# Altium schematic sheet Motor.SchDoc
size A4
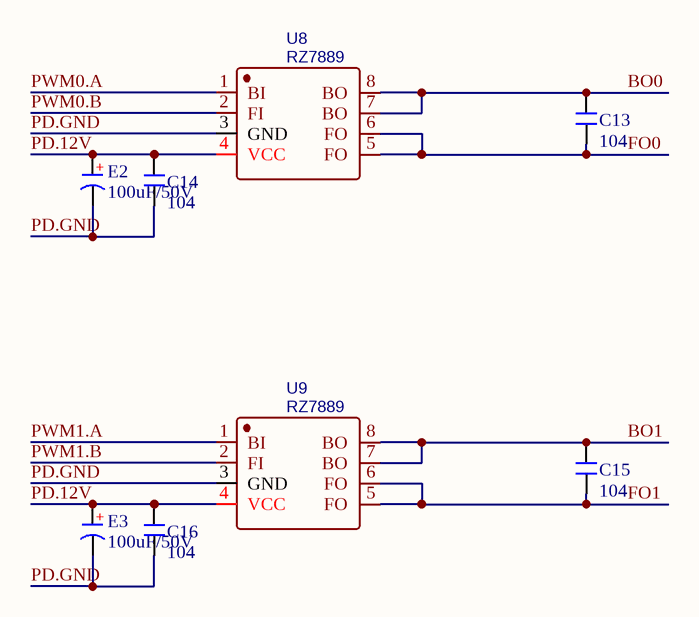
[diagram p0: Motor.SchDoc]

## Parts
C13  104  [C 0603]
C14  104  [C 0603]
C15  104  [C 0603]
C16  104  [C 0603]
E2  100uF/50V  [CM F(10*10.2)]
E3  100uF/50V  [CM F(10*10.2)]
U8  RZ7889  [SOP8_L]
U9  RZ7889  [SOP8_L]

## Nets
BO0: C13.2 U8.7(BO) U8.8(BO)
BO1: C15.2 U9.7(BO) U9.8(BO)
FO0: C13.1 U8.5(FO) U8.6(FO)
FO1: C15.1 U9.5(FO) U9.6(FO)
PD.12V: C14.2 C16.2 E2.1(A) E3.1(A) U8.4(VCC) U9.4(VCC)
PD.GND: C14.1 C16.1 E2.2(K) E3.2(K) U8.3(GND) U9.3(GND)
PWM0.A: U8.1(BI)
PWM0.B: U8.2(FI)
PWM1.A: U9.1(BI)
PWM1.B: U9.2(FI)

## Notes on the sheet
- (in symbol C-CM) +

## Library data of the parts
C13-C16 = C: 无极性贴片电容; 版权归属: 源创客; 材质: X7R; BOM名称: 无极性贴片电容; 学习资源: www.ooocke.com
E2 E3 = C-CM: 贴片电解电容; 版权归属: 源创客; BOM名称: 贴片电解电容; 学习资源: www.ooocke.com
U8 U9 = RZ7889: BOM_Manufacturer: RZ; BOM_Paste Type: recommend; BOM_Supplier: LCSC; BOM_Manufacturer Part: RZ7889; BOM_Supplier Part: C83668; spicePre: U; spiceSymbolName: RZ7889